# Altium project zasilacz symetryczny.PrjPcb
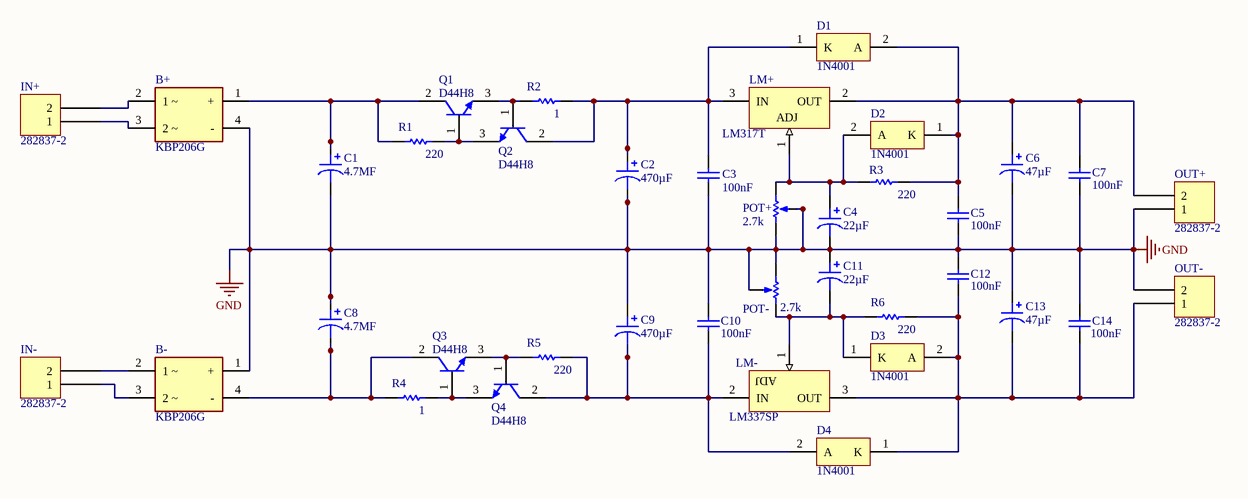
[diagram p0: zasilacz_symetryczny_schemat.SchDoc]
1 sheet, 38 parts. Net scope: global (net labels, ports and power ports of the same name join across sheets).
Board file: zasilaczsymetr.PcbDoc

## Sheet zasilacz_symetryczny_schemat.SchDoc
size A4; SheetNumber: 1; SheetTotal: 1; SPICEModelCacheNWDNFYIL: <root> / <DocumentId>NWDNFYIL</DocumentId> / </root>

### Parts
B+  KBP206G  [FP-KBP-MFG]
B-  KBP206G  [FP-KBP-MFG]
C1  4.7MF  [CAP TH ALUM ELEC D18.00mm S7.50mm H21.50mm]
C2  470µF  [CAP TH ALUM ELEC D12.50mm S5.00mm H14.00mm]
C3  value 100nF  [RAD-0.3]  (hidden comment: Cap)
C4  22µF  [CAP TH ALUM ELEC D5.00mm S2.00mm H11.00mm]
C5  value 100nF  [RAD-0.3]  (hidden comment: Cap)
C6  47µF  [CAP TH ALUM ELEC D6.30mm S2.50mm H11.00mm]
C7  value 100nF  [RAD-0.3]  (hidden comment: Cap)
C8  4.7MF  [CAP TH ALUM ELEC D18.00mm S7.50mm H21.50mm]
C9  470µF  [CAP TH ALUM ELEC D12.50mm S5.00mm H14.00mm]
C10  value 100nF  [RAD-0.3]  (hidden comment: Cap)
C11  22µF  [CAP TH ALUM ELEC D5.00mm S2.00mm H11.00mm]
C12  value 100nF  [RAD-0.3]  (hidden comment: Cap)
C13  47µF  [CAP TH ALUM ELEC D6.30mm S2.50mm H11.00mm]
C14  value 100nF  [RAD-0.3]  (hidden comment: Cap)
D1  1N4001  [ONSC-AXIAL_LEAD-2-59-10_P]
D2  1N4001  [ONSC-AXIAL_LEAD-2-59-10_P]
D3  1N4001  [ONSC-AXIAL_LEAD-2-59-10_P]
D4  1N4001  [ONSC-AXIAL_LEAD-2-59-10_P]
IN+  282837-2  [TE 282837-2]
IN-  282837-2  [TE 282837-2]
LM+  LM317T  [NDE0003A]
LM-  LM337SP  [TO220]
OUT+  282837-2  [TE 282837-2]
OUT-  282837-2  [TE 282837-2]
POT+  value 2.7k  [VR5]  (hidden comment: RPot)
POT-  value 2.7k  [VR5]  (hidden comment: RPot)
Q1  D44H8  [ONSC-TO-220-3-221A-09]
Q2  D44H8  [ONSC-TO-220-3-221A-09]
Q3  D44H8  [ONSC-TO-220-3-221A-09]
Q4  D44H8  [ONSC-TO-220-3-221A-09]
R1  value 220  [AXIAL-0.3]  (hidden comment: Res1)
R2  value 1  [AXIAL-0.3]  (hidden comment: Res1)
R3  value 220  [AXIAL-0.3]  (hidden comment: Res1)
R4  value 1  [AXIAL-0.3]  (hidden comment: Res1)
R5  value 220  [AXIAL-0.3]  (hidden comment: Res1)
R6  value 220  [AXIAL-0.3]  (hidden comment: Res1)

### Nets
GND: B+.4(-) B-.1(+) C1.2 C2.2 C3.1 C4.2 C5.1 C6.2 C7.1 C8.1 C9.1 C10.2 C11.1 C12.2 C13.1 C14.2 OUT+.1 OUT-.2 POT+.1(TOP) POT+.3(TAP) POT-.1(TOP) POT-.3(TAP)
NetB+_1: B+.1(+) C1.1 Q1.2(C) R1.1
NetB+_2: B+.2(1_~) IN+.2
NetB+_3: B+.3(2_~) IN+.1
NetB-_2: B-.2(1_~) IN-.2
NetB-_3: B-.3(2_~) IN-.1
NetB-_4: B-.4(-) C8.2 Q3.2(C) R4.1
NetC2_1: C2.1 C3.2 D1.1(K) LM+.3(IN) Q2.2(C) R2.2
NetC4_1: C4.1 D2.2(A) LM+.1(ADJ) POT+.2(BOT) R3.1
NetC5_2: C5.2 C6.1 C7.2 D1.2(A) D2.1(K) LM+.2(OUT) OUT+.2 R3.2
NetC9_2: C9.2 C10.1 D4.2(A) LM-.2(IN) Q4.2(C) R5.2
NetC11_2: C11.2 D3.1(K) LM-.1(ADJ) POT-.2(BOT) R6.1
NetC12_1: C12.1 C13.2 C14.1 D3.2(A) D4.1(K) LM-.3(OUT) OUT-.1 R6.2
NetQ1_1: Q1.1(B) Q2.3(E) R1.2
NetQ1_3: Q1.3(E) Q2.1(B) R2.1
NetQ3_1: Q3.1(B) Q4.3(E) R4.2
NetQ3_3: Q3.3(E) Q4.1(B) R5.1

### Library data of the parts
B+ B- = CMP-12791-000035-1: BRIDGE RECT 1PHASE 600V 2A KBP; Manufacturer: Diodes Inc.; Capacitance: 25pF; Max Junction Temp: +150°C; Value: 25pF; Max Surge Forward Current: 65A; Peak Reverse Current: 5uA; Standoff Height: 1.8mm; Octopart: https://octopart.com/kbp206g-diodes+inc.-330175; Footprint Url: https://www.diodes.com/assets/Package-Files/KBP.pdf; Device Class L2: Diodes; Category: Diode; Reverse Voltage: 600V; Device Class L3: Rectifier Diodes; Manufacturer Part Number: KBP206G; Height: 12.8mm; Device Class L1: Discrete Semiconductors; Mouser Description: Bridge Rectifiers 2.0A 600V; ComponentLink2Description: Datasheet; Forward Current: 2A; Automotive: No; RoHS: TRUE; Temperature Range High: +150°C; ComponentLink2URL: https://www.diodes.com/assets/Datasheets/ds21205.pdf; Digikey Description: BRIDGE RECT 1PHASE 600V 2A KBP; Temperature: -65°C to +150°C; Temperature Range Low: -65°C; Package: KBP; Max Repetitive Reverse Voltage: 600V; Lead Free: Yes
C1 C8 = EKYC250ELL472MM20S: ALUMINUM CAPACITOR; manufacturer: United Chemi-Con; ESR (Equivalent Series Resistance): 37mOhm @ 100kHz; Lifetime @ Temp.: 5000 Hrs @ 105°C; Polarization: Polar; Ripple Current @ High Frequency: 2.7A @ 100kHz; Ripple Current @ Low Frequency: 2.295A @ 120Hz; Tolerance: ±20%; Voltage - Rated: 25V; Part Number: EKYC250ELL472MM20S; Applications: Automotive; Capacitance: 4.7MF; componentlink1description: Datasheet; componentlink1url: http://www.chemi-con.co.jp/cgi-bin/CAT_DB/SEARCH/cat_db_al.cgi?e=e&j=p&pdfname=kyc; componentlink2description: DigiKey Link; componentlink2url: http://digikey.com/product-detail/en/united-chemi-con/EKYC250ELL472MM20S/565-EKYC250ELL472MM20S-ND/10486416; Device Package: Radial, Can; Height - Seated (Max): 0.846" (21.50mm); lastupdated: 02.09.2020 01:33:14; Lead Spacing: 0.295" (7.50mm); Lifecycle Status: Active; Minimum Order: 1; Mounting Type: Through Hole; Operating Temperature: -40°C ~ 105°C; Package / Case: Radial, Can; packaging: Bulk; partid: 18010; Part Status: Active; price: 1.57; Ratings: AEC-Q200; series: KYC; Size / Dimension: 0.709" Dia (18.00mm); Supplier 1: DigiKey; Supplier Part Number 1: 565-EKYC250ELL472MM20S-ND; value: 4.7MF
C2 C9 = URZ1V471MHD: CAP ALUM 470UF 20% 35V RADIAL; manufacturer: Nichicon; Lifetime @ Temp.: 1000 Hrs @ 105°C; Polarization: Polar; Ripple Current @ Low Frequency: 420mA @ 120Hz; Part Number: URZ1V471MHD; Applications: General Purpose; Capacitance: 470µF; componentlink1description: Datasheet; componentlink1url: http://nichicon-us.com/english/products/pdfs/e-urz.pdf; componentlink2description: DigiKey Link; componentlink2url: http://digikey.com/product-detail/en/nichicon/URZ1V471MHD/493-15958-ND/2539001; Device Package: Radial, Can; Height - Seated (Max): 0.551" (14.00mm); lastupdated: 02.09.2020 01:31:53; Lead Spacing: 0.197" (5.00mm); Lifecycle Status: Active; Minimum Order: 1; Mounting Type: Through Hole; Operating Temperature: -55°C ~ 105°C; Package / Case: Radial, Can; packaging: Bulk; partid: 13716; Part Status: Active; price: 0.78; series: URZ; Size / Dimension: 0.492" Dia (12.50mm); Supplier 1: DigiKey; Supplier Part Number 1: 493-15958-ND; Tolerance: ±20%; value: 470µF; Voltage - Rated: 35V
C3 C5 C7 C10 C12 C14 = Cap: Capacitor; Published: 8-Jun-2000; LatestRevisionDate: 17-Jul-2002; LatestRevisionNote: Re-released for DXP Platform.; PackageReference: RAD-0.3; Publisher: Altium Limited; PackageDescription: Radial Cap, Thru-Hole; 2 Leads; 0.3 in Pin Spacing
C4 C11 = EEU-FC1V220: CAP ALUM 22UF 20% 35V RADIAL; manufacturer: Panasonic Electronic Components; Impedance: 800 mOhms; Lifetime @ Temp.: 1000 Hrs @ 105°C; Polarization: Polar; Ripple Current @ High Frequency: 175mA @ 100kHz; Ripple Current @ Low Frequency: 113.8mA @ 120Hz; Part Number: EEU-FC1V220; Applications: Automotive; Capacitance: 22µF; componentlink1description: Datasheet; componentlink1url: http://industrial.panasonic.com/www-cgi/jvcr13pz.cgi?E+PZ+3+ABA0022+EEUFC1V220+7+WW; componentlink2description: DigiKey Link; componentlink2url: http://digikey.com/product-detail/en/panasonic-electronic-components/EEU-FC1V220/P11230-ND/356133; Device Package: Radial, Can; Height - Seated (Max): 0.433" (11.00mm); lastupdated: 04.09.2020 23:28:57; Lead Spacing: 0.079" (2.00mm); Lifecycle Status: Active; Minimum Order: 1; Mounting Type: Through Hole; Operating Temperature: -55°C ~ 105°C; Package / Case: Radial, Can; packaging: Bulk; partid: 21502; Part Status: Active; price: 0.29; Ratings: AEC-Q200; series: FC; Size / Dimension: 0.197" Dia (5.00mm); Supplier 1: DigiKey; Supplier Part Number 1: P11230-ND; Tolerance: ±20%; value: 22µF; Voltage - Rated: 35V
C6 C13 = UKW1H470MED: CAP ALUM 47UF 20% 50V RADIAL; manufacturer: Nichicon; Lifetime @ Temp.: 2000 Hrs @ 85°C; Polarization: Polar; Ripple Current @ High Frequency: 300mA @ 10kHz; Ripple Current @ Low Frequency: 150mA @ 120Hz; Part Number: UKW1H470MED; Applications: Audio; Capacitance: 47µF; componentlink1description: Datasheet; componentlink1url: http://nichicon-us.com/english/products/pdfs/e-ukw.pdf; componentlink2description: DigiKey Link; componentlink2url: http://digikey.com/product-detail/en/nichicon/UKW1H470MED/493-15492-ND/1964262; Device Package: Radial, Can; Height - Seated (Max): 0.433" (11.00mm); lastupdated: 04.09.2020 01:05:43; Lead Spacing: 0.098" (2.50mm); Lifecycle Status: Active; Minimum Order: 1; Mounting Type: Through Hole; Operating Temperature: -40°C ~ 85°C; Package / Case: Radial, Can; packaging: Bulk; partid: 19951; Part Status: Active; price: 0.47; series: UKW; Size / Dimension: 0.248" Dia (6.30mm); Supplier 1: DigiKey; Supplier Part Number 1: 493-15492-ND; Tolerance: ±20%; value: 47µF; Voltage - Rated: 50V
D1-D4 = CMP-0902-00117-1: Standard Recovery Rectifier, 2-Pin Axial_Lead, Pb-Free, Bulk Bag; Manufacturer: On Semiconductor; VRRM Max (V): 50; IFSM Max (A): 30; IO(rec) Max (A): 1; ComponentLink3URL: http://www.onsemi.cn/pub_link/Collateral/59-10.PDF; ComponentLink3Description: Package Specification; PartNumber: 1N4001; PackageVersion: Rev. U, 02/2005; Packing: Bulk Bag; ComponentLink2Description: Datasheet; RoHS: TRUE; DatasheetVersion: Rev. 13; PackageReference: AXIAL_LEAD-2-59-10; ComponentLink1URL: http://www.onsemi.com/; Mounting Technology: Through Hole; PackageDescription: 2-Pin, Axial Lead, Diameter 2.35 mm; ComponentLink2URL: http://www.onsemi.com/pub_link/Collateral/1N4001-D.PDF; Type: Standard Recovery; ComponentLink1Description: Manufacturer URL
IN+ IN- OUT+ OUT- = 282837-2: TERM BLK 2P SIDE ENT 5.08MM PCB; Manufacturer: TE Connectivity AMP Connectors; Current: 13.5 A; Mating Orientation: Horizontal with Board; Number of Levels: 1; Pitch: 0.200" (5.08mm); Positions Per Level: 2; Voltage: 300 V; Wire Gauge: 16-28 AWG; Wire Termination: Screw - Rising Cage Clamp; Part Number: 282837-2; Color: Green; ComponentLink1Description: Datasheet; ComponentLink1URL: https://www.te.com/commerce/DocumentDelivery/DDEController?Action=srchrtrv&DocNm=282837&DocType=Customer+Drawing&DocLang=English; ComponentLink2Description: DigiKey Link; ComponentLink2URL: https://www.digikey.com/en/products/detail/te-connectivity-amp-connectors/282837-2/2187973; Features: Interlocking (Side); LastUpdated: 21.06.2022 15:00:23; Lifecycle Status: Active; Minimum Order: 1; Mounting Type: Through Hole; Packaging: Tray; Part Status: Active; Price: 0.31; Series: Buchanan; Supplier 1: DigiKey; Supplier Part Number 1: A113320-ND
LM+ = CMP-0062-02456-3: 3-Terminal Adjustable Regulator, 3-pin TO-220; Manufacturer: Texas Instruments; CompType: LDO IC; PowerWise: N; PackageTopMarking: NSUZXYTTE#*LM317T P+; ComponentLink1Description: Datasheet URL; PackageReference: NDE0003A; PinCount: 3; ComponentLink1URL: http://www.ti.com/general/docs/lit/getliterature.tsp?genericPartNumber=LM317-N&fileType=pdf; RoHS: N; PackageDescription: TO-220, Molded, 3 Lead, Straight
LM- = CMP-0244-00420-1: Three-Terminal Negative Voltage Regulator, 3-Pin TO-220; PackageReference: TO220; DatasheetVersion: 1/10/2011; ComponentLink3Description: Package Specification; ComponentLink3URL: http://www.st.com/internet/com/TECHNICAL_RESOURCES/TECHNICAL_LITERATURE/PACKAGE_INFORMATION/CD00004649.pdf; PackageDescription: TO, Thru-Hole, Vertical, Heatsink Mounted; 3 In-Line Leads; Pitch 2.54 mm; PackageVersion: ver3.0; ComponentLink1Description: Manufacturer URL; ComponentLink1URL: http://www.st.com; ComponentLink2Description: Datasheet; ComponentLink2URL: http://www.st.com/internet/com/TECHNICAL_RESOURCES/TECHNICAL_LITERATURE/DATASHEET/CD00000468.pdf
POT+ POT- = RPot: Potentiometer; Sim Note: Enter the Resistance value and the set point into parameter fields.; Set Position: 0.5; Published: 8-Jun-2000; LatestRevisionDate: 17-Jul-2002; LatestRevisionNote: Re-released for DXP Platform.; PackageReference: VR5; Publisher: Altium Limited; PackageDescription: Variable Resistor, Thru-Hole; 3 Leads
Q1-Q4 = CMP-1048-01189-1: Complementary Silicon Power Transistor, 3-Pin TO-220, Tube; Manufacturer: On Semiconductor; IC Continuous (A): 10; Polarity: NPN; PackageDescription: 3-Pin Flange Mount, Vertical Straight Lead, Body 9.97 x 4.445 mm, Pitch 2.54 mm; ComponentLink2URL: http://www.onsemi.com/pub_link/Collateral/D44H-D.PDF; DatasheetVersion: Rev. 12; Mounting Technology: Through Hole; Packing: Tube; PackageReference: TO-220-3-221A-09; ComponentLink1Description: Manufacturer URL; ComponentLink2Description: Datasheet; ComponentLink3Description: Package Specification; PartNumber: D44H8; ComponentLink1URL: http://www.onsemi.com/; RoHS: FALSE; ComponentLink3URL: http://www.onsemi.com/pub_link/Collateral/221A-09.PDF; PackageVersion: Rev. AG, 09/2011
R1-R6 = Res1: Resistor; Published: 8-Jun-2000; LatestRevisionDate: 17-Jul-2002; LatestRevisionNote: Re-released for DXP Platform.; PackageReference: AXIAL-0.3; Publisher: Altium Limited; PackageDescription: Axial Device, Thru-Hole; 2 Leads; 0.3 in Pin Spacing